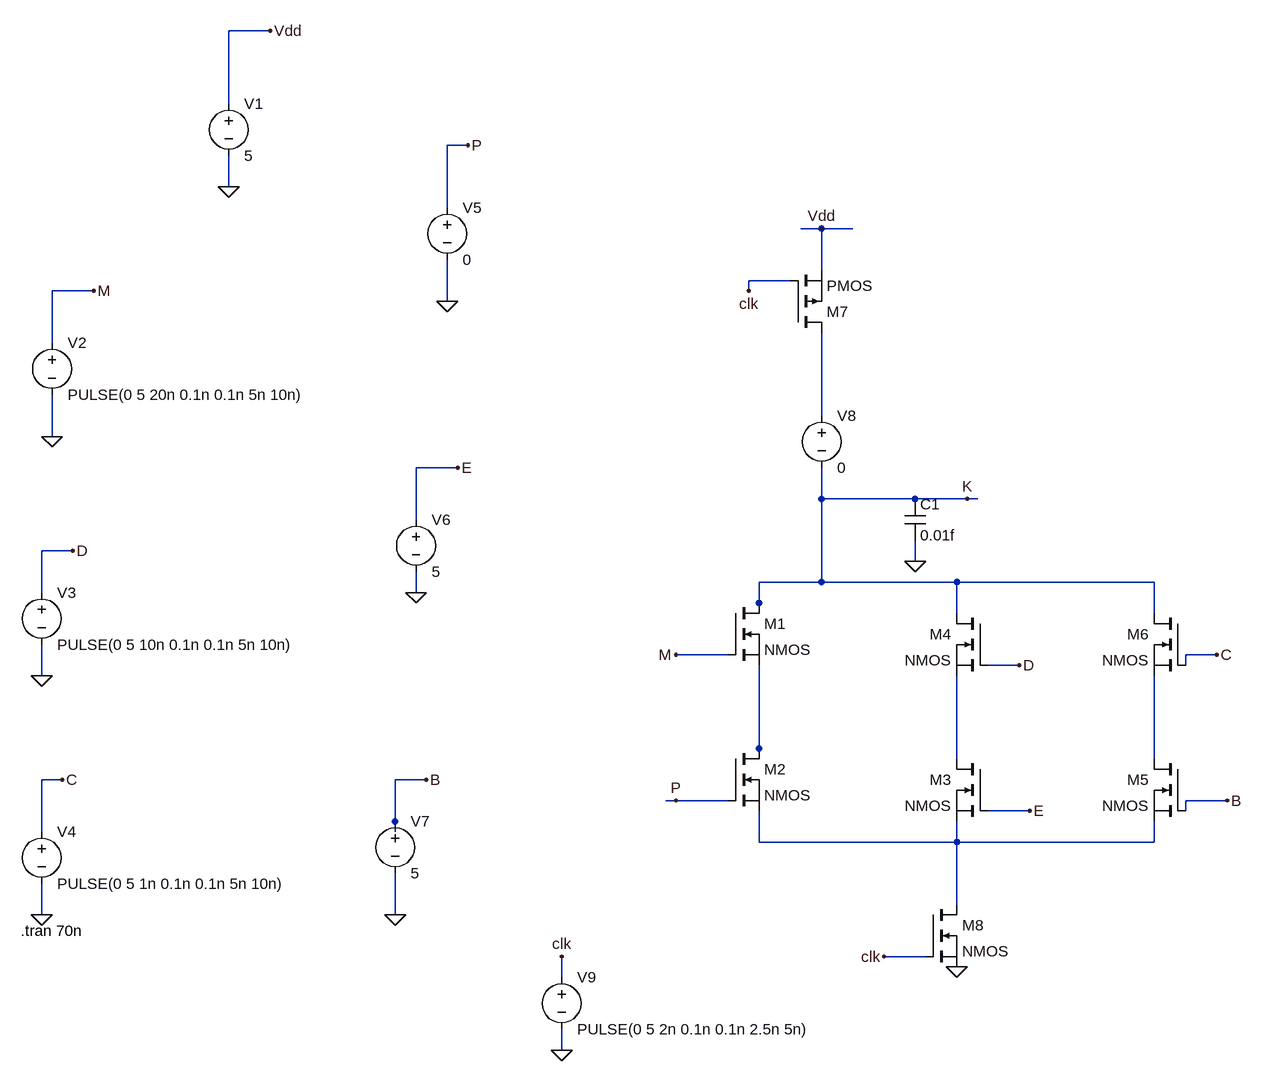
[diagram p0: schematic 5_1_3.asc]
5_1_3.asc, the LTspice schematic file:
Version 4
SHEET 1 1052 868
WIRE -656 -720 -720 -720
WIRE -720 -608 -720 -720
WIRE -352 -544 -384 -544
WIRE -720 -480 -720 -528
WIRE -384 -448 -384 -544
WIRE 192 -416 160 -416
WIRE 240 -416 192 -416
WIRE 192 -352 192 -416
WIRE 144 -336 80 -336
WIRE -928 -320 -992 -320
WIRE 80 -320 80 -336
WIRE -384 -304 -384 -368
WIRE -992 -240 -992 -320
WIRE 192 -128 192 -256
WIRE -992 -96 -992 -160
WIRE -368 -48 -432 -48
WIRE 192 0 192 -48
WIRE 336 0 192 0
WIRE 416 0 336 0
WIRE 432 0 416 0
WIRE -432 32 -432 -48
WIRE -960 80 -1008 80
WIRE 336 96 336 64
WIRE 192 128 192 0
WIRE 192 128 96 128
WIRE 400 128 192 128
WIRE 704 128 400 128
WIRE -1008 144 -1008 80
WIRE -432 144 -432 112
WIRE 96 160 96 128
WIRE 96 176 96 160
WIRE 400 176 400 128
WIRE 704 176 704 128
WIRE 48 240 -32 240
WIRE 800 240 752 240
WIRE 496 256 448 256
WIRE 752 256 752 240
WIRE -1008 272 -1008 224
WIRE 96 384 96 256
WIRE 96 400 96 384
WIRE 400 400 400 272
WIRE 704 400 704 272
WIRE -976 432 -1008 432
WIRE -416 432 -464 432
WIRE -32 464 -48 464
WIRE 48 464 -32 464
WIRE 816 464 752 464
WIRE 512 480 448 480
WIRE 752 480 752 464
WIRE -464 496 -464 432
WIRE -1008 512 -1008 432
WIRE -464 512 -464 496
WIRE 96 528 96 480
WIRE 400 528 400 496
WIRE 400 528 96 528
WIRE 704 528 704 496
WIRE 704 528 400 528
WIRE 400 624 400 528
WIRE -1008 640 -1008 592
WIRE -464 640 -464 576
WIRE 352 704 288 704
WIRE -208 736 -208 704
WIRE -208 848 -208 816
FLAG 416 0 Κ
FLAG -32 240 Μ
FLAG -32 464 P
FLAG 496 256 D
FLAG 512 480 E
FLAG 800 240 C
FLAG 816 464 B
FLAG -656 -720 Vdd
FLAG -720 -480 0
FLAG -928 -320 M
FLAG -352 -544 P
FLAG -960 80 D
FLAG -368 -48 E
FLAG -976 432 C
FLAG -416 432 B
FLAG -1008 640 0
FLAG -464 640 0
FLAG -432 144 0
FLAG -1008 272 0
FLAG -992 -96 0
FLAG -384 -304 0
FLAG 192 -416 Vdd
FLAG 80 -320 clk
FLAG 400 720 0
FLAG 288 704 clk
FLAG -208 704 clk
FLAG -208 848 0
FLAG 336 96 0
SYMBOL nmos 48 160 R0
SYMATTR InstName M1
SYMBOL nmos 48 384 R0
SYMATTR InstName M2
SYMBOL nmos 448 400 M0
SYMATTR InstName M3
SYMBOL nmos 448 176 M0
SYMATTR InstName M4
SYMBOL nmos 752 400 M0
SYMATTR InstName M5
SYMBOL nmos 752 176 M0
SYMATTR InstName M6
SYMBOL voltage -720 -624 R0
WINDOW 123 0 0 Left 0
WINDOW 39 0 0 Left 0
SYMATTR InstName V1
SYMATTR Value 5
SYMBOL voltage -992 -256 R0
WINDOW 123 0 0 Left 0
WINDOW 39 0 0 Left 0
SYMATTR InstName V2
SYMATTR Value PULSE(0 5 20n 0.1n 0.1n 5n 10n)
SYMBOL voltage -1008 128 R0
WINDOW 123 0 0 Left 0
WINDOW 39 0 0 Left 0
SYMATTR InstName V3
SYMATTR Value PULSE(0 5 10n 0.1n 0.1n 5n 10n)
SYMBOL voltage -1008 496 R0
WINDOW 123 0 0 Left 0
WINDOW 39 0 0 Left 0
SYMATTR InstName V4
SYMATTR Value PULSE(0 5 1n 0.1n 0.1n 5n 10n)
SYMBOL voltage -384 -464 R0
WINDOW 123 0 0 Left 0
WINDOW 39 0 0 Left 0
SYMATTR InstName V5
SYMATTR Value 0
SYMBOL voltage -432 16 R0
WINDOW 123 0 0 Left 0
WINDOW 39 0 0 Left 0
SYMATTR InstName V6
SYMATTR Value 5
SYMBOL voltage -464 480 R0
WINDOW 123 0 0 Left 0
WINDOW 39 0 0 Left 0
SYMATTR InstName V7
SYMATTR Value 5
SYMBOL voltage 192 -144 R0
WINDOW 123 0 0 Left 0
WINDOW 39 0 0 Left 0
SYMATTR InstName V8
SYMATTR Value 0
SYMBOL pmos 144 -256 M180
SYMATTR InstName M7
SYMBOL nmos 352 624 R0
SYMATTR InstName M8
SYMBOL voltage -208 720 R0
WINDOW 123 0 0 Left 0
WINDOW 39 0 0 Left 0
SYMATTR InstName V9
SYMATTR Value PULSE(0 5 2n 0.1n 0.1n 2.5n 5n)
SYMBOL cap 320 0 R0
SYMATTR InstName C1
SYMATTR Value 0.01f
TEXT -1040 664 Left 2 !.tran 70n

The netlist it stands for:
* 5_1_3.asc
M1 Κ Μ N002 N002 NMOS
M2 N002 P N005 N005 NMOS
M3 N003 E N005 N005 NMOS
M4 Κ D N003 N003 NMOS
M5 N004 B N005 N005 NMOS
M6 Κ C N004 N004 NMOS
V1 Vdd 0 5
V2 M 0 PULSE(0 5 20n 0.1n 0.1n 5n 10n)
V3 D 0 PULSE(0 5 10n 0.1n 0.1n 5n 10n)
V4 C 0 PULSE(0 5 1n 0.1n 0.1n 5n 10n)
V5 P 0 0
V6 E 0 5
V7 B 0 5
V8 N001 Κ 0
M7 N001 clk Vdd Vdd PMOS
M8 N005 clk 0 0 NMOS
V9 clk 0 PULSE(0 5 2n 0.1n 0.1n 2.5n 5n)
C1 Κ 0 0.01f
.model NMOS NMOS
.model PMOS PMOS
.lib standard.mos
.tran 70n
.backanno
.end